# Altium schematic sheet Power MOSFETS.SchDoc
size A4
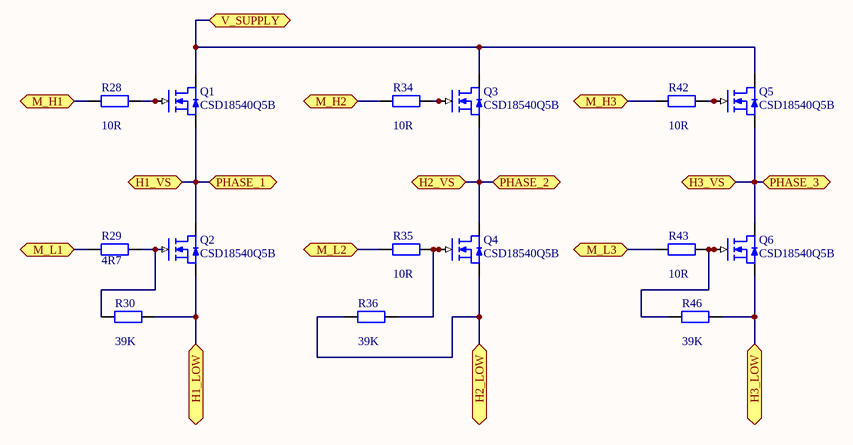
[diagram p0: Power MOSFETS.SchDoc]

## Parts
Q1  CSD18540Q5B  [SON5X6]
Q2  CSD18540Q5B  [SON5X6]
Q3  CSD18540Q5B  [SON5X6]
Q4  CSD18540Q5B  [SON5X6]
Q5  CSD18540Q5B  [SON5X6]
Q6  CSD18540Q5B  [SON5X6]
R28  10R  [0603-2]
R29  value 4R7  [0603-2]  (hidden comment: 10R)
R30  39K  [0603-2]
R34  10R  [0603-2]
R35  10R  [0603-2]
R36  39K  [0603-2]
R42  10R  [0603-2]
R43  10R  [0603-2]
R46  39K  [0603-2]

## Ports
H1_LOW, H1_VS, H2_LOW, H2_VS, H3_LOW, H3_VS, M_H1, M_H2, M_H3, M_L1, M_L2, M_L3, PHASE_1, PHASE_2, PHASE_3, V_SUPPLY

## Nets
H1_LOW: Q2.1(S) R30.2 ; port H1_LOW
H1_VS: Q1.1(S) Q2.8(D) ; port H1_VS, port PHASE_1
H2_LOW: Q4.1(S) R36.1 ; port H2_LOW
H2_VS: Q3.1(S) Q4.8(D) ; port H2_VS, port PHASE_2
H3_LOW: Q6.1(S) R46.2 ; port H3_LOW
H3_VS: Q5.1(S) Q6.8(D) ; port H3_VS, port PHASE_3
M_H1: R28.1 ; port M_H1
M_H2: R34.1 ; port M_H2
M_H3: R42.1 ; port M_H3
M_L1: R29.1 ; port M_L1
M_L2: R35.1 ; port M_L2
M_L3: R43.1 ; port M_L3
V_SUPPLY: Q1.8(D) Q3.8(D) Q5.8(D) ; port V_SUPPLY
NetQ1_4: Q1.4(G) R28.2
NetQ2_4: Q2.4(G) R29.2 R30.1
NetQ3_4: Q3.4(G) R34.2
NetQ4_4: Q4.4(G) R35.2 R36.2
NetQ5_4: Q5.4(G) R42.2
NetQ6_4: Q6.4(G) R43.2 R46.1

## Library data of the parts
R28 R34 R35 R42 R43 = Res1: 贴片电阻; Value: 4R7; Published: 8-Jun-2000; LatestRevisionDate: 17-Jul-2002; LatestRevisionNote: Re-released for DXP Platform.; PackageReference: AXIAL-0.4; Publisher: Altium Limited
R29 R30 R36 R46 = Res1: 贴片电阻; Published: 8-Jun-2000; LatestRevisionDate: 17-Jul-2002; LatestRevisionNote: Re-released for DXP Platform.; PackageReference: AXIAL-0.4; Publisher: Altium Limited
  R30 R36 R46: Value: 39k